# Altium schematic sheet mV_meter.SchDoc: Title
size 420 x 297 mm; Author: G.Kasprowicz; CompanyName: WUT ISE; DrawnBy: G.Kasprowicz; Organization: WUT ISE; Address1: PW ISE; Address2: Nowowiejska 15/19 00-665 Warsaw; Address3: gkasprow@gmail.com; Revision: 2; SheetNumber: 1; SheetTotal: 5; ModifiedBy: -; CheckedDate: -; Title2: Title 2; DivGrp: WUT ISE; Designer: G.Kasprowicz; ModifiedDate: -; ProjectName: Sensor Box
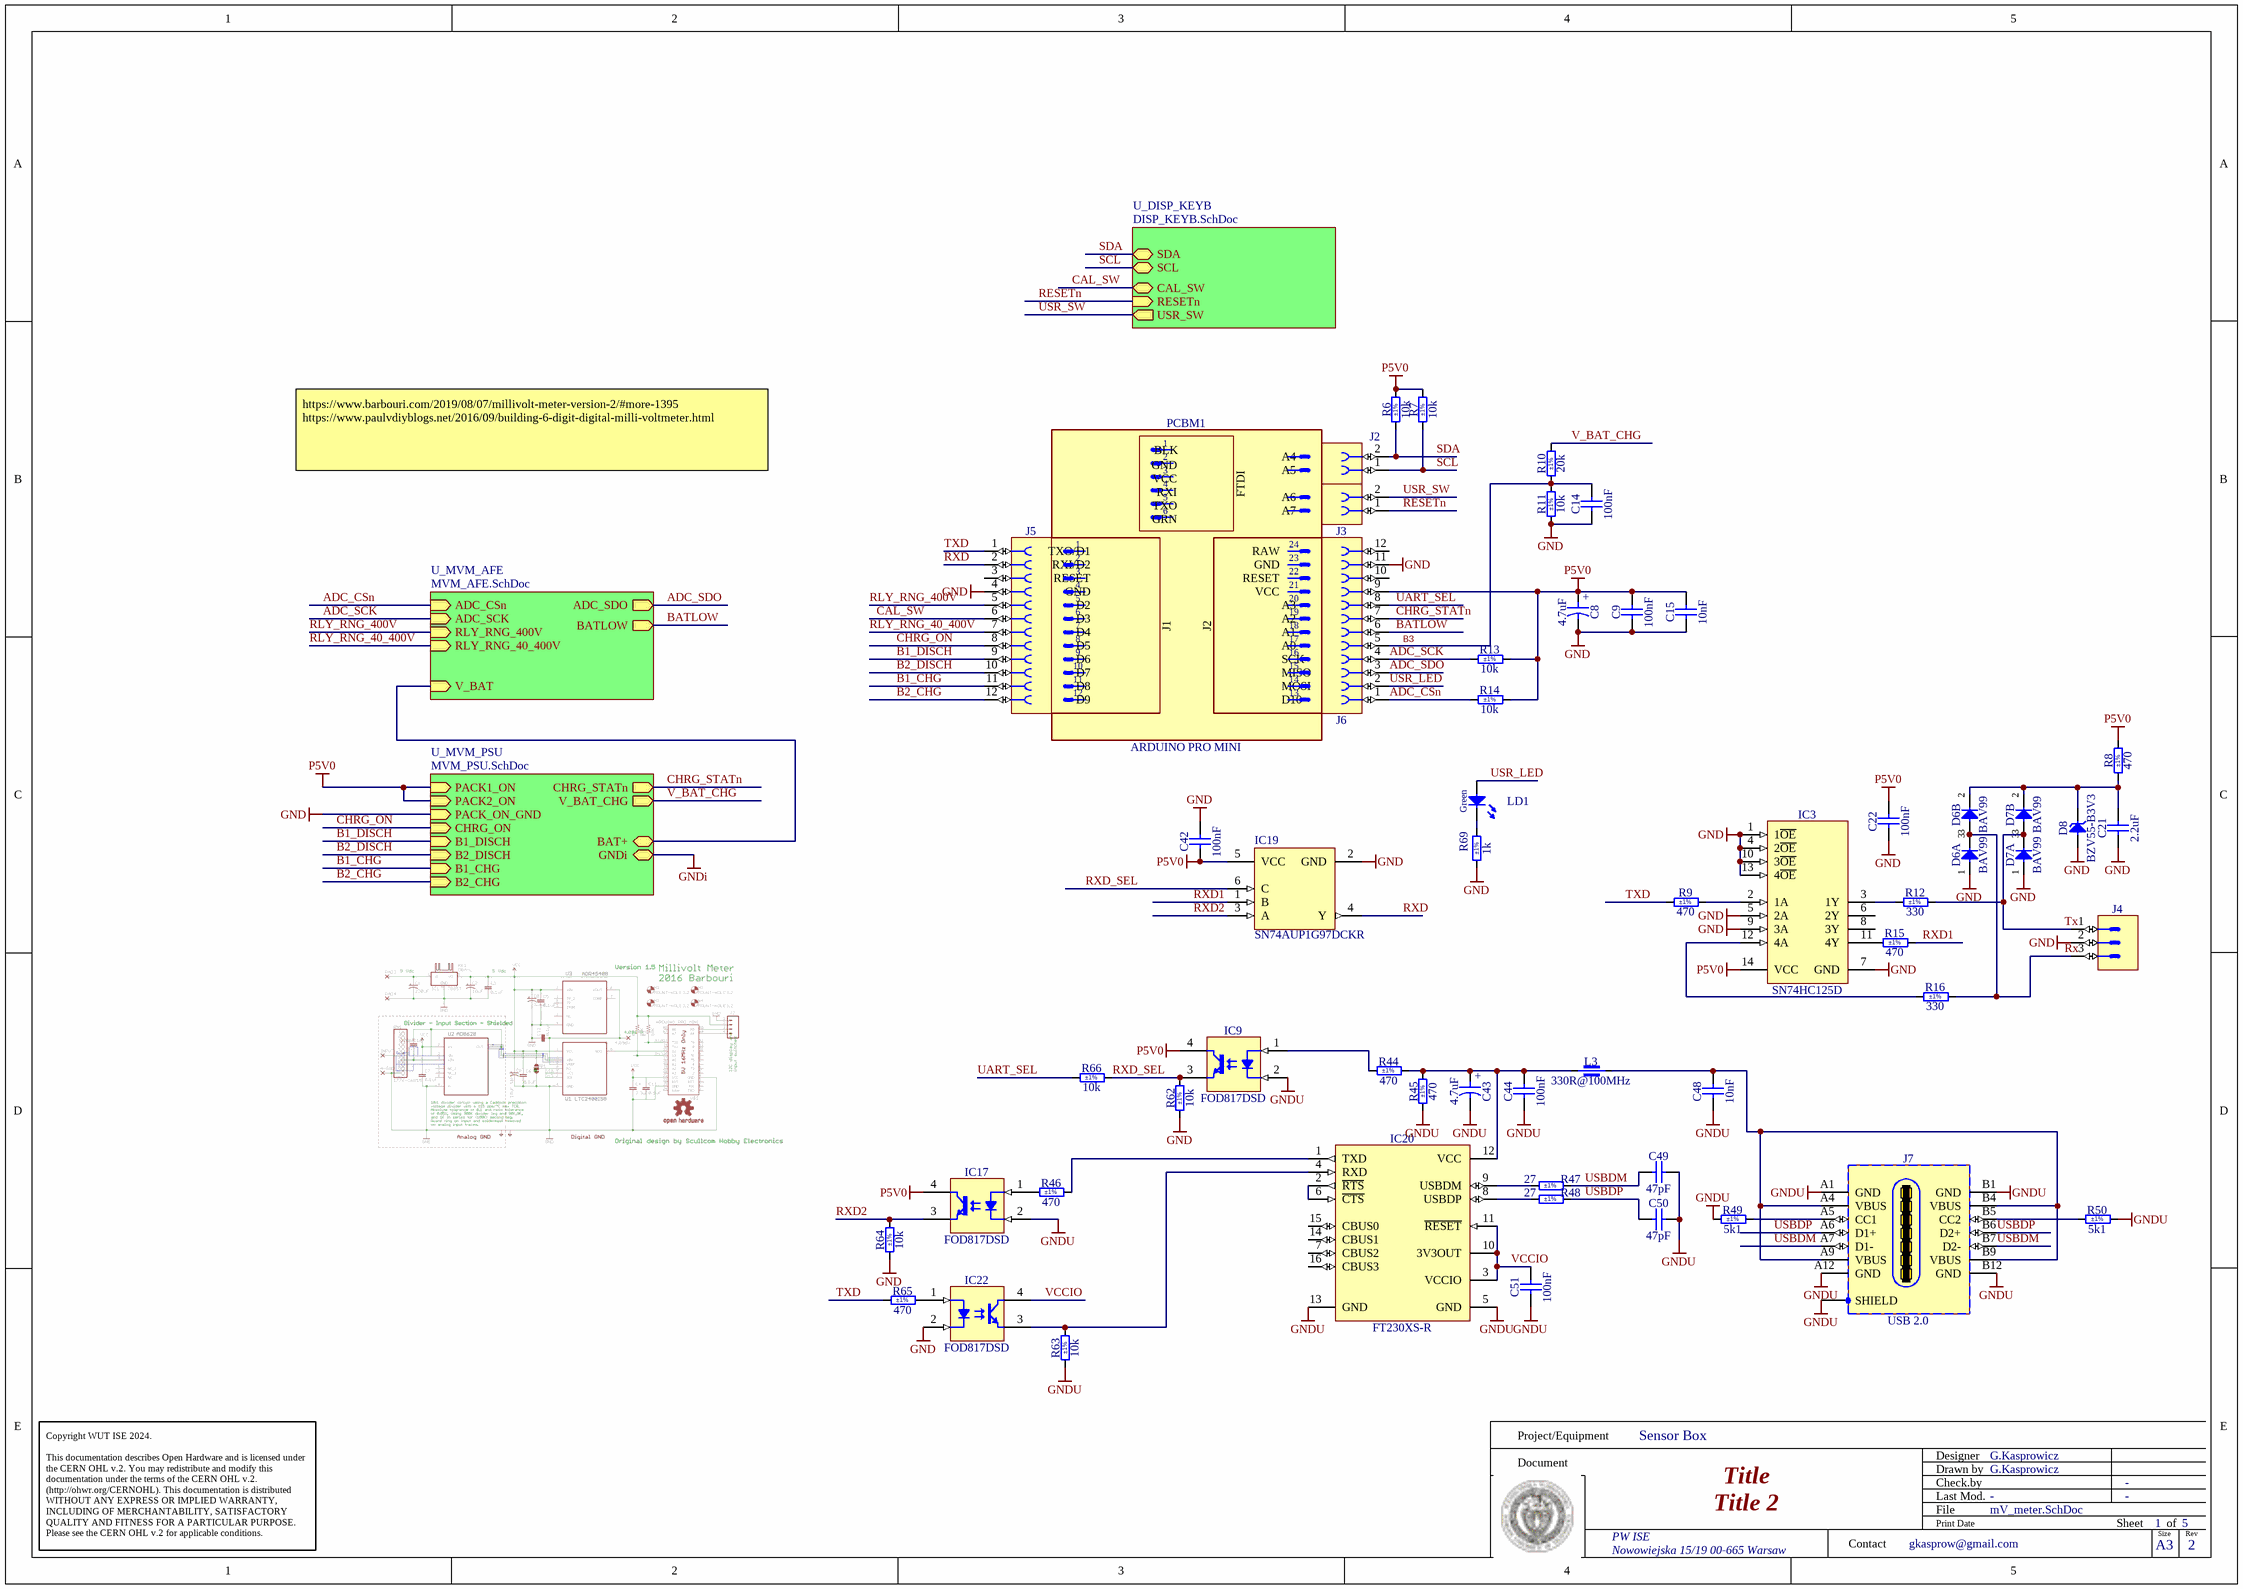
[diagram p0: mV_meter.SchDoc]

## Parts
C8  4.7uF  [CAPMP3216X180N]
C9  100nF  [CAPC2012X88N]
C14  100nF  [CAPC2012X88N]
C15  10nF  [CAPC2012X135N]
C21  2.2uF  [CAPC1608X90N]
C22  100nF  [CAPC1608X90N]
C42  100nF  [CAPC1608X90N]
C43  4.7uF  [CAPMP3216X180N]
C44  100nF  [CAPC1608X90N]
C48  10nF  [CAPC2012X135N]
C49  47pF  [CAPC1608X87N]
C50  47pF  [CAPC1608X87N]
C51  100nF  [CAPC1608X90N]
D6  BAV99  [SOT95P240X110-3N]  (parts A,B of 2)
D7  BAV99  [SOT95P240X110-3N]  (parts A,B of 2)
D8  BZV55-B3V3  [DIOMELF3515N]
IC3  SN74HC125D  [SOIC127P600X175-14N]
IC9  FOD817DSD  [FAIRCHILD_FOD817DSD]
IC17  FOD817DSD  [FAIRCHILD_FOD817DSD]
IC19  SN74AUP1G97DCKR  [DCK0006A_M]
IC20  FT230XS-R  [SOP63P600X175-16N]
IC22  FOD817DSD  [FAIRCHILD_FOD817DSD]
J2  Socket 2  [SAMTEC_SSW-102-02-G-S]  (value not drawn)
J3  Socket 2  [SAMTEC_SSW-102-02-G-S]  (value not drawn)
J4  (no value)  [PHOENIX_1803280]
J5  Socket 12  [SAMTEC_SSW-112-01-G-S]  (value not drawn)
J6  Socket 12  [SAMTEC_SSW-112-01-G-S]  (value not drawn)
J7  USB 2.0  [KYCON_KUSBX-SL-CS1N14-B]
L3  330R@100MHz  [INDC1608X75N]
LD1  Green  [LED_AVAGO_HSME-C110]
PCBM1  ARDUINO PRO MINI  [PCBM_ARDUINO PRO MINI]
R6  10k  Tolerance: ±1%  [RESC1608X55N]
R7  10k  Tolerance: ±1%  [RESC1608X55N]
R8  470  Tolerance: ±1%  [RESC1608X55N]
R9  470  Tolerance: ±1%  [RESC1608X55N]
R10  20k  Tolerance: ±1%  [RESC1608X55N]
R11  10k  Tolerance: ±1%  [RESC1608X55N]
R12  330  Tolerance: ±1%  [RESC1608X55N]
R13  10k  Tolerance: ±1%  [RESC1608X55N]
R14  10k  Tolerance: ±1%  [RESC1608X55N]
R15  470  Tolerance: ±1%  [RESC1608X55N]
R16  330  Tolerance: ±1%  [RESC1608X55N]
R44  470  Tolerance: ±1%  [RESC1608X55N]
R45  470  Tolerance: ±1%  [RESC1608X55N]
R46  470  Tolerance: ±1%  [RESC1608X55N]
R47  27  Tolerance: ±1%  [RESC1608X55N]
R48  27  Tolerance: ±1%  [RESC1608X55N]
R49  5k1  Tolerance: ±1%  [RESC1608X55N]
R50  5k1  Tolerance: ±1%  [RESC1608X55N]
R62  10k  Tolerance: ±1%  [RESC1608X55N]
R63  10k  Tolerance: ±1%  [RESC1608X55N]
R64  10k  Tolerance: ±1%  [RESC1608X55N]
R65  470  Tolerance: ±1%  [RESC1608X55N]
R66  10k  Tolerance: ±1%  [RESC1608X55N]
R69  1k  Tolerance: ±1%  [RESC1608X55N]

## Sub-sheets
U_DISP_KEYB = DISP_KEYB.SchDoc: SDA (bidir), SCL (bidir), CAL_SW (bidir), RESETn (in), USR_SW (out)
U_MVM_AFE = MVM_AFE.SchDoc: ADC_CSn (in), ADC_SCK (in), ADC_SDO (out), RLY_RNG_400V (in), RLY_RNG_40_400V (in), BATLOW (out), V_BAT (in)
U_MVM_PSU = MVM_PSU.SchDoc: PACK1_ON (in), PACK2_ON (in), PACK_ON_GND (in), CHRG_ON (in), CHRG_STATn (out), B1_DISCH (in), B2_DISCH (in), B1_CHG (in), B2_CHG (in), BAT+ (bidir), GNDi (bidir), V_BAT_CHG (out)

## Nets
GND: C8.2 C9.1 C14.1 C15.1 C21.1 C22.1 C42.1 D6.1(A) D7.1(A) D8.2(A) IC3.1(1~{OE}) IC3.4(2~{OE}) IC3.5(2A) IC3.7(GND) IC3.9(3A) IC3.10(3~{OE}) IC3.13(4~{OE}) IC19.2(GND) IC22.2(C) J4.2 J5.4 J6.11 R11.1 R62.1 R64.1 R69.1 ; sheet U_MVM_PSU/PACK_ON_GND
GNDi: sheet U_MVM_PSU/GNDi
GNDU: C43.2 C44.1 C48.1 C49.2 C50.2 C51.1 IC9.2(C) IC17.2(C) IC20.5(GND) IC20.13(GND) J7.A1(GND) J7.A12(GND) J7.B1(GND) J7.B12(GND) J7.SHIELD R45.1 R49.1 R50.2 R63.1
P5V0: C8.1 C9.2 C15.2 C22.2 C42.2 IC3.14(VCC) IC9.4(C) IC17.4(C) IC19.5(VCC) J6.9 R6.2 R7.2 R8.2 R13.2 R14.2 ; sheet U_MVM_PSU/PACK1_ON, sheet U_MVM_PSU/PACK2_ON
ADC_CSn: J6.1 R14.1 ; sheet U_MVM_AFE/ADC_CSn
ADC_SCK: J6.4 R13.1 ; sheet U_MVM_AFE/ADC_SCK
ADC_SDO: J6.3 ; sheet U_MVM_AFE/ADC_SDO
B1_CHG: J5.11 ; sheet U_MVM_PSU/B1_CHG
B1_DISCH: J5.9 ; sheet U_MVM_PSU/B1_DISCH
B2_CHG: J5.12 ; sheet U_MVM_PSU/B2_CHG
B2_DISCH: J5.10 ; sheet U_MVM_PSU/B2_DISCH
B3: C14.2 J6.5 R10.1 R11.2
BATLOW: J6.6 ; sheet U_MVM_AFE/BATLOW
CAL_SW: J5.6 ; sheet U_DISP_KEYB/CAL_SW
CHRG_ON: J5.8 ; sheet U_MVM_PSU/CHRG_ON
CHRG_STATn: J6.7 ; sheet U_MVM_PSU/CHRG_STATn
RESETn: J3.1 ; sheet U_DISP_KEYB/RESETn
RLY_RNG_40_400V: J5.7 ; sheet U_MVM_AFE/RLY_RNG_40_400V
RLY_RNG_400V: J5.5 ; sheet U_MVM_AFE/RLY_RNG_400V
Rx: D6.3(COMAC) J4.3 R16.2
RXD: IC19.4(Y) J5.2
RXD1: IC19.1(B) R15.2
RXD2: IC17.3(E) IC19.3(A) R64.2
RXD_SEL: IC9.3(E) IC19.6(C) R62.2 R66.2
SCL: J2.1 R7.1 ; sheet U_DISP_KEYB/SCL
SDA: J2.2 R6.1 ; sheet U_DISP_KEYB/SDA
Tx: D7.3(COMAC) J4.1 R12.2
TXD: J5.1 R9.1 R65.1
UART_SEL: J6.8 R66.1
USBDM: C49.1 J7.A7(D1-) J7.B7(D2-) R47.2
USBDP: C50.1 J7.A6(D1+) J7.B6(D2+) R48.2
USR_LED: J6.2 LD1.2(A)
USR_SW: J3.2 ; sheet U_DISP_KEYB/USR_SW
V_BAT_CHG: R10.2 ; sheet U_MVM_PSU/V_BAT_CHG
VCCIO: C51.2 IC20.3(VCCIO) IC20.10(3V3OUT) IC20.11(~{RESET}) IC22.4(C)
NetC21_2: C21.2 D6.2(C) D7.2(C) D8.1(C) R8.1
NetC43_1: C43.1 C44.2 IC20.12(VCC) L3.1 R44.2 R45.2
NetC48_2: C48.2 J7.A4(VBUS) J7.A9(VBUS) J7.B4(VBUS) J7.B9(VBUS) L3.2
NetIC3_2: IC3.2(1A) R9.2
NetIC3_3: IC3.3(1Y) R12.1
NetIC3_11: IC3.11(4Y) R15.1
NetIC3_12: IC3.12(4A) R16.1
NetIC9_1: IC9.1(A) R44.1
NetIC17_1: IC17.1(A) R46.1
NetIC20_1: IC20.1(TXD) R46.2
NetIC20_2: IC20.2(~{RTS}) IC20.6(~{CTS})
NetIC20_4: IC20.4(RXD) IC22.3(E) R63.2
NetIC20_8: IC20.8(USBDP) R48.1
NetIC20_9: IC20.9(USBDM) R47.1
NetIC22_1: IC22.1(A) R65.2
NetJ7_A5: J7.A5(CC1) R49.2
NetJ7_B5: J7.B5(CC2) R50.1
NetLD1_1: LD1.1(C) R69.2
(unnamed): sheet U_MVM_PSU/BAT+, sheet U_MVM_AFE/V_BAT

Not connected (* = marked no-connect by the designer): IC3 6(2Y) 8(3Y); IC20 7(CBUS2) 14(CBUS1) 15(CBUS0) 16(CBUS3); J5 3; J6 10 12

## Notes on the sheet
- https://www.barbouri.com/2019/08/07/millivolt-meter-version-2/#more-1395
  https://www.paulvdiyblogs.net/2016/09/building-6-digit-digital-milli-voltmeter.html
- Project/Equipment
- Document
- Designer
- Drawn by
- Check.by
- Copyright WUT ISE 2024.
  This documentation describes Open Hardware and is licensed under the CERN OHL v.2. You may redistribute and modify this documentation under the terms of the CERN OHL v.2. (http://ohwr.org/CERNOHL). This documentation is distributed WITHOUT ANY EXPRESS OR IMPLIED WARRANTY, INCLUDING OF MERCHANTABILITY, SATISFACTORY QUALITY AND FITNESS FOR A PARTICULAR PURPOSE. Please see the CERN OHL v.2 for applicable conditions.
- Contact
- File
- Last Mod.
- Print Date
- Sheet
- Size
- A3
- of
- Rev
- (in symbol CTE3216-18_4.7UF_10V_10%_LESR1400) +
- (in symbol PCBM_ARDUINO PRO MINI extra pins) 1; BLK; 2; A4; GND; 3; A5; VCC; 4; FTDI; RXI; 5; A6; TXO; 6; A7; GRN; 24; TXO/D1; RAW; 23; RXI/D2; 22; RESET; 21; 20; D2; A3; 19; D3; A2; 7; J1; J2; 18; D4; A1; 8; 17; D5; A0; 9; 16; D6; SCK; 10; 15; D7; MISO; 11; 14; D8; MOSI; 12; 13; D9; D10

## Library data of the parts
C8 C43 = CTE3216-18_4.7UF_10V_10%_LESR1400: Polarised capacitor; Part Description: Low ESR 1R4 Solid Tantalum Chip Capacitor; Manufacturer: GENERIC; Manufacturer1 Part Number: TPSA475K010R1400; Voltage: 10V; Tolerance: ±10%; Part Number: CTE3216-18_4.7UF_10V_10%_LESR1400; Component Kind: Standard; Component Type: Standard; Pin Count: 2; Value: 4.7uF; Status: Preferred; Manufacturer Part Number: CTE3216-18_4.7UF_10V_10%_LESR1400; Case: A; Mounted: Yes; Socket: No; SMD: Yes; Sense: No; Manufacturer1 Example: AVX; Manufacturer1 ComponentHeight: 1.8mm; HelpURL: \\cern.ch\dfs\Applications\Altium\Datasheets\CTE-LESR_AVX_TPS.pdf; Author: CERN DEM JLC; CreateDate: 05.05.2008; LatestRevisionDate: 20.01.2009
C9 C14 = CC0805_100NF_50V_1%_NP0: Non-polarised capacitor; Part Description: SMD Multilayer Chip Ceramic Capacitor; Manufacturer: GENERIC; Manufacturer1 Part Number: 0805N103F500C; Voltage: 50V; TC: C0G/NP0; Tolerance: ±1%; Part Number: CC0805_100NF_50V_1%_NP0; Component Kind: Standard; Component Type: Standard; Footprint: CAPC2012X135N; Pin Count: 2; Value: 100nF; Status: Not Recommended; Manufacturer Part Number: CC0805_100NF_50V_1%_NP0; Case: 0805; Mounted: Yes; Socket: No; SMD: Yes; Sense: No; ComponentHeight: 1.35mm; Manufacturer1 Example: WALSIN TECHNOLOGY CORPORATION; Manufacturer1 ComponentHeight: 1.35mm; HelpURL: \\cern.ch\dfs\Applications\Altium\Datasheets\CC0805_WALSIN_0805.pdf; Author: CERN DEM HF; CreateDate: 28.08.2023; LatestRevisionDate: 28.08.2023
C15 C48 = CC0805_10NF_50V_5%_C0G: Non-polarised capacitor; Part Description: SMD Multilayer Chip Ceramic Capacitor; Manufacturer: GENERIC; Manufacturer1 Part Number: C0805C103J5GACTU; Voltage: 50V; TC: C0G/NP0; Tolerance: ±5%; Part Number: CC0805_10NF_50V_5%_C0G; Component Kind: Standard; Component Type: Standard; Pin Count: 2; Value: 10nF; Status: None; Manufacturer Part Number: CC0805_10NF_50V_5%_C0G; Case: 0805; Mounted: Yes; Socket: No; SMD: Yes; Sense: No; Manufacturer1 Example: KEMET; Manufacturer1 ComponentHeight: 0.88mm; HelpURL: \\cern.ch\dfs\Applications\Altium\Datasheets\CC0805_C0G_KEMET_(Commercial Grade).pdf; Author: CERN DEM JLC; CreateDate: 02.02.2011; LatestRevisionDate: 22.04.2015
C21 = CC0603_2.2UF_10V_20%_X7R: Non-polarised capacitor; Part Description: SMD Multilayer Chip Ceramic Capacitor; Manufacturer: GENERIC; Manufacturer1 Part Number: LMK107B7225MA-T; Voltage: 10V; TC: X7R; Tolerance: ±20%; Part Number: CC0603_2.2UF_10V_20%_X7R; Component Kind: Standard; Component Type: Standard; Pin Count: 2; Value: 2.2uF; Status: Not Recommended; Manufacturer Part Number: CC0603_2.2UF_10V_20%_X7R; Case: 0603; Mounted: Yes; Socket: No; SMD: Yes; Sense: No; Manufacturer1 Example: TAIYO YUDEN; Manufacturer1 ComponentHeight: 0.9mm; HelpURL: \\cern.ch\dfs\Applications\Altium\Datasheets\CC0603_X7R_TAIYO-YUDEN_HIGH-VALUE.pdf; Author: CERN DEM JLC; CreateDate: 22.06.2011; LatestRevisionDate: 27.06.2011
C22 C42 C44 C51 = CC0603_100NF_100V_10%_X7R: Non-polarised capacitor; Part Description: SMD Multilayer Chip Ceramic Capacitor; Manufacturer: GENERIC; Manufacturer1 Part Number: GRM188R72A104KA35D; Voltage: 100V; TC: X7R; Tolerance: ±10%; Part Number: CC0603_100NF_100V_10%_X7R; Component Kind: Standard; Component Type: Standard; Pin Count: 2; Value: 100nF; Status: None; Manufacturer Part Number: CC0603_100NF_100V_10%_X7R; Case: 0603; Mounted: Yes; Socket: No; SMD: Yes; Sense: No; Manufacturer1 Example: MURATA; Manufacturer1 ComponentHeight: 0.9mm; HelpURL: \\cern.ch\dfs\Applications\Altium\Datasheets\CC0603_MURATA_GRM188R72A104KA35D.pdf; Author: CERN DEM JLC; CreateDate: 11.12.2013; LatestRevisionDate: 11.12.2013
C49 C50 = CC0603_47PF_50V_5%_NP0: Non-polarised capacitor; Part Description: SMD Multilayer Chip Ceramic Capacitor; Manufacturer: GENERIC; Manufacturer1 Part Number: 223886715479; Voltage: 50V; TC: C0G/NP0; Tolerance: ±5%; Part Number: CC0603_47PF_50V_5%_NP0; Component Kind: Standard; Component Type: Standard; Pin Count: 2; Value: 47pF; Status: Preferred; Manufacturer Part Number: CC0603_47PF_50V_5%_NP0; Case: 0603; Mounted: Yes; Socket: No; SMD: Yes; Sense: No; Manufacturer1 Example: PHYCOMP; Manufacturer1 ComponentHeight: 0.87mm; HelpURL: \\cern.ch\dfs\Applications\Altium\Datasheets\CC0603_NP0_PHYCOMP.pdf; Author: CERN DEM JLC; CreateDate: 03.12.2007; LatestRevisionDate: 03.12.2007
D6 D7 = BAV99: Serial Diode; Part Description: Dual Series Signal Diode; Manufacturer: FAIRCHILD SEMICONDUCTOR; Voltage: 70V; Power: 350mW; PressFit: No; Bonding: No; Part Number: BAV99; Component Kind: Standard; Component Type: Standard; Device: BAV99; PackageDescription: SOT, 0.95mm Pitch; 3 Pin, 1.40mm W X 3.00mm L X 1.10mm H body, IPC Medium Density; Manufacturer Part Number: BAV99; Pin Count: 3; Case: SOT23-3; Mounted: Yes; Socket: No; SMD: Yes; Sense: No; ComponentHeight: 1.1mm; HelpURL: \\cern.ch\dfs\Applications\Altium\Datasheets\BAV99.pdf; Author: CERN DEM JLC; CreateDate: 06.05.2008; LatestRevisionDate: 27.09.2012
D8 = BZV55-B3V3: Zener Diode; Part Description: Voltage Regulator Diode; Manufacturer: NEXPERIA; Voltage: 3V3; Power: 500mW; PressFit: No; Bonding: No; Part Number: BZV55-B3V3; Component Kind: Standard; Component Type: Standard; Device: BZV55-B3V3; PackageDescription: SOD80C, MELF Diode, 2-Leads, Body 3.5x1.5mm, IPC Medium Density; Manufacturer Part Number: BZV55-B3V3; Pin Count: 2; Case: SOD-80C; Mounted: Yes; Socket: No; SMD: Yes; Sense: No; ComponentHeight: 1.6mm; HelpURL: \\cern.ch\dfs\Applications\Altium\Datasheets\BZV55.pdf; Author: CERN DEM JLC; CreateDate: 06.05.2008; LatestRevisionDate: 22.01.2018
IC3 = SN74HC125D: Quadruple Bus Buffer with 3-State Outputs; Manufacturer: TEXAS INSTRUMENTS; PressFit: No; Bonding: No; Part Number: SN74HC125D; Component Kind: Standard; Component Type: Standard; Device: SN74HC125D; PackageDescription: SOIC 14, Pitch 1.27mm - Body 4x8.75mm, IPC Medium Density; Part Description: Quadruple Bus Buffer with 3-State Outputs; Manufacturer Part Number: SN74HC125D; Pin Count: 14; Case: SOIC14; Mounted: Yes; Socket: No; SMD: Yes; Sense: No; ComponentHeight: 1.75mm; Author: CERN DEM JLC; HelpURL: \\cern.ch\dfs\Applications\Altium\Datasheets\SN74HC125D.pdf; CreateDate: 30.06.2011; LatestRevisionDate: 30.06.2011
IC9 IC17 IC22 = FOD817DSD: Single Optocoupler; Part Description: 4-Pin High Operating Temperature Phototransistor Optocoupler; Manufacturer: FAIRCHILD SEMICONDUCTOR; PressFit: No; Bonding: No; Part Number: FOD817DSD; Component Kind: Standard; Component Type: Standard; Device: FOD817DSD; PackageDescription: SOIC, 2.54mm Pitch; 4 Pin, 6.50mm W X 4.60mm L X 4.60mm H body; Manufacturer Part Number: FOD817DSD; Pin Count: 4; Case: SOIC4; Mounted: Yes; Socket: No; SMD: Yes; Sense: No; ComponentHeight: 4.6mm; HelpURL: \\cern.ch\dfs\Applications\Altium\Datasheets\FOD817DSD.pdf; Author: CERN DEM JLC; CreateDate: 21.07.2014; LatestRevisionDate: 21.07.2014
IC19 = CMP-0859-00523-3: Low-Power Configurable Multiple-Function Gate, DCK0006A, LARGE T&R; Manufacturer: Texas Instruments; VCC(Min)(V): 0.8; Logic: True; Output Drive (IOL/IOH)(Max)(mA): 20/-20; 3-State Output: No; Voltage(Nom)(V): 0.8,1.2,1.5,1.8,2.5,3.3; Output Type: CMOS; Rating: Catalog; Technology Family: AUP; VCC(Max)(V): 3.6; Sub-Family: Configurable Logic; Bits(#): 1; ICC @ Nom Voltage(Max)(mA): 0.0009; tpd @ Nom Voltage(Max)(ns): 36.7,21.4,14.8,11.8,8.8,7.3; F @ Nom Voltage(Max)(Mhz): 100; DatasheetVersion: SCES505J; Gate Type: Configurable; Operating Temperature Range(C): -40 to 85; Generic Part Number: SN74AUP1G97; PackageReference: DCK0006A; Schmitt Trigger: No; Input Type: CMOS
IC20 = FT230XS-R: USB To Basic UART IC; Part Description: USB to Serial UART Interface; Manufacturer: FUTURE TECHNOLOGY DEVICES INTERNATIONAL (FTDI); PressFit: No; Bonding: No; Part Number: FT230XS-R; Component Kind: Standard; Component Type: Standard; Device: FT230XS-R; PackageDescription: SOP, 0.635mm Pitch; 16 Pin, 3.9mm W X 4.895mm L X 1.75mm H body, IPC Medium Density; Manufacturer Part Number: FT230XS-R; Pin Count: 16; Case: SSOP16; Mounted: Yes; Socket: No; SMD: Yes; Sense: No; ComponentHeight: 1.75mm; Author: CERN DEM JLC; HelpURL: \\cern.ch\dfs\Applications\Altium\Datasheets\FT230XS-R.pdf; CreateDate: 12.02.2013; LatestRevisionDate: 12.02.2013
J2 J3 = SAMTEC_SSW-102-02-G-S: Connector 2 Female; Part Description: 2 Contacts, Pitch 2.54mm, Single Row Through Mount Straight Socket (Lead Length 4.93mm); Manufacturer: SAMTEC; PressFit: No; Part Number: SAMTEC_SSW-102-02-G-S; Component Kind: Standard; Component Type: Standard; Pin Count: 2; Family: Socket 2; Mounted: Yes; Socket: No; SMD: No; Sense: No; Status: None; Manufacturer Part Number: SSW-102-02-G-S; ComponentHeight: 8.51mm; HelpURL: \\cern.ch\dfs\Applications\Altium\Datasheets\SAMTEC_SSW-102-02-G-S.pdf; Author: CERN DEM JLC; CreateDate: 27.01.2011; LatestRevisionDate: 27.01.2011
J4 = PHOENIX_1803280: Connector 3 Male; Part Description: 8A 160 V, Pitch: 3.81mm, 3 Positions  Right Angled Header; Manufacturer: PHOENIX CONTACT; Manufacturer Part Number: 1803277 (MC 1,5/ 3-G-3,81); PressFit: No; Part Number: PHOENIX_1803280; Component Kind: Standard; Component Type: Standard; Pin Count: 3; Mounted: Yes; Socket: No; SMD: No; Sense: No; Status: None; ComponentHeight: 7.25mm; HelpURL: \\cern.ch\dfs\Applications\Altium\Datasheets\PHOENIX_1803280.pdf; Author: CERN DEM BC; CreateDate: 23.09.2019; LatestRevisionDate: 23.09.2019
J5 J6 = SAMTEC_SSW-112-01-G-S: Connector 12 Female; Part Description: 12 Contacts, Pitch 2.54mm, Single Row Through Mount Straight Socket (Lead Length 2.64mm); Manufacturer: SAMTEC; PressFit: No; Part Number: SAMTEC_SSW-112-01-G-S; Component Kind: Standard; Component Type: Standard; Pin Count: 12; Family: Socket 12; Mounted: Yes; Socket: No; SMD: No; Sense: No; Status: None; Manufacturer Part Number: SSW-112-01-G-S; ComponentHeight: 8.51mm; HelpURL: \\cern.ch\dfs\Applications\Altium\Datasheets\SAMTEC_SSW-112-01-G-S.pdf; Author: CERN DEM BR; CreateDate: 30.04.2019; LatestRevisionDate: 30.04.2019
J7 = KYCON_KUSBX-SL-CS1N14-B: 2x7 Pin + 1 Shield  USB Type C Receptacle; Part Description: USB 2.0 Type C Receptacle, High Temp., Flag Style Through Hole 14 Pin, Black; Manufacturer: KYCON; PressFit: No; Part Number: KYCON_KUSBX-SL-CS1N14-B; Component Kind: Standard; Component Type: Standard; Pin Count: 18; Family: USB 2.0; Mounted: Yes; Socket: No; SMD: No; Sense: No; Status: None; Manufacturer Part Number: KUSBX-SL-CS1N14-B; ComponentHeight: 8.34mm; HelpURL: \\cern.ch\dfs\Applications\Altium\Datasheets\KYCON_KUSBX-SL-CS1N14-B.pdf; Author: CERN DEM BC; CreateDate: 03.11.2020; LatestRevisionDate: 03.11.2020
L3 = IND0603_TDK_MPZ1608S331ATA00: Part Description: SMT Chip Bead for Power Line; Manufacturer: TDK; Power: 1.7A; Resistance: 0.08R; Tolerance: ±25%; Part Number: IND0603_TDK_MPZ1608S331ATA00; Component Kind: Standard; Component Type: Standard; Pin Count: 2; Value: 330R@100MHz; Manufacturer Part Number: MPZ1608S331ATA00; Case: 0603; Mounted: Yes; Socket: No; SMD: Yes; Sense: No; ComponentHeight: 0.8mm; HelpURL: \\cern.ch\dfs\Applications\Altium\Datasheets\IND0603_TDK_MPZ1608.pdf; Author: CERN DEM JLC; CreateDate: 10.01.2018; LatestRevisionDate: 25.10.2018
LD1 = LED_AVAGO_HSME-C110: LED Green 1C 2A; Part Description: High Performance Right Angle Chip Green LED; Manufacturer: AVAGO TECHNOLOGIES; PressFit: No; Bonding: No; Part Number: LED_AVAGO_HSME-C110; Component Kind: Standard; Component Type: Standard; Color: Green; PackageDescription: Green Chip LED, 2-Leads, Body 3.3x1.6mm, Side Emitting Package; Manufacturer Part Number: HSME-C110; Pin Count: 2; Case: 1206; Mounted: Yes; Socket: No; SMD: Yes; Sense: No; ComponentHeight: 1.1mm; HelpURL: \\cern.ch\dfs\Applications\Altium\Datasheets\LED_AVAGO_HSME-C110.pdf; ComponentLink1URL: \\cern.ch\dfs\Applications\Altium\Datasheets\LED_AVAGO_HSME-C110_DESIGN-GUIDE.pdf; ComponentLink1Description: Design Guide; Author: CERN DEM JMW; CreateDate: 30.07.2009; LatestRevisionDate: 20.06.2012
PCBM1 = PCBM_ARDUINO PRO MINI extra pins: Arduino PRO MINI Printed Circuit Board Module; PressFit: No; Bonding: No; Part Number: PCBM_ARDUINO PRO MINI; Component Kind: Accessories; Component Type: Standard; Device: ARDUINO PRO MINI; PackageDescription: Microcontroller Board Arduino PRO MINI; Part Description: Arduino PRO MINI Printed Circuit Board Module; Manufacturer: ARDUINO; Manufacturer Part Number: ARDUINO PRO MINI; Pin Count: 0; Mounted: Yes; Socket: No; SMD: No; Sense: No; ComponentHeight: 15.4mm; Author: CERN DEM HF; HelpURL: \\cern.ch\dfs\Applications\Altium\Datasheets\PCBM_ARDUINO PRO MINI.pdf; CreateDate: 06.09.2022; LatestRevisionDate: 06.09.2022
R6 R7 R11 R13 R14 R62-R64 R66 = R0603_10K_1%_0.1W_100PPM: Resistor - 1%; Part Description: General Purpose Thick Film Chip Resistor; Manufacturer: GENERIC; Manufacturer1 Part Number: NRC06F1002TRF; Power: 0.1W; TC: ±100ppm/°C; PressFit: No; Part Number: R0603_10K_1%_0.1W_100PPM; Component Kind: Standard; Component Type: Standard; Pin Count: 2; Value: 10k; Status: Preferred; Manufacturer Part Number: R0603_10K_1%_0.1W_100PPM; Case: 0603; Mounted: Yes; Sense: No; Socket: No; SMD: Yes; Manufacturer1 Example: NIC COMPONENT; Manufacturer1 ComponentHeight: 0.55mm; HelpURL: \\cern.ch\dfs\Applications\Altium\Datasheets\R0603_NIC_NRC.pdf; Author: CERN DEM JLC; CreateDate: 03.12.2007; LatestRevisionDate: 13.03.2008
R8 R9 R15 R44-R46 R65 = R0603_470R_1%_0.1W_100PPM: Resistor - 1%; Part Description: General Purpose Thick Film Chip Resistor; Manufacturer: GENERIC; Manufacturer1 Part Number: NRC06F4700TRF; Power: 0.1W; TC: ±100ppm/°C; PressFit: No; Part Number: R0603_470R_1%_0.1W_100PPM; Component Kind: Standard; Component Type: Standard; Pin Count: 2; Value: 470; Status: Preferred; Manufacturer Part Number: R0603_470R_1%_0.1W_100PPM; Case: 0603; Mounted: Yes; Sense: No; Socket: No; SMD: Yes; Manufacturer1 Example: NIC COMPONENT; Manufacturer1 ComponentHeight: 0.55mm; HelpURL: \\cern.ch\dfs\Applications\Altium\Datasheets\R0603_NIC_NRC.pdf; Author: CERN DEM JLC; CreateDate: 03.12.2007; LatestRevisionDate: 13.03.2008
R10 = R0603_20K_1%_0.1W_100PPM: Resistor - 1%; Part Description: General Purpose Thick Film Chip Resistor; Manufacturer: GENERIC; Manufacturer1 Part Number: NRC06F2002TRF; Power: 0.1W; TC: ±100ppm/°C; PressFit: No; Part Number: R0603_20K_1%_0.1W_100PPM; Component Kind: Standard; Component Type: Standard; Pin Count: 2; Value: 20k; Status: Preferred; Manufacturer Part Number: R0603_20K_1%_0.1W_100PPM; Case: 0603; Mounted: Yes; Sense: No; Socket: No; SMD: Yes; Manufacturer1 Example: NIC COMPONENT; Manufacturer1 ComponentHeight: 0.55mm; HelpURL: \\cern.ch\dfs\Applications\Altium\Datasheets\R0603_NIC_NRC.pdf; Author: CERN DEM JLC; CreateDate: 03.12.2007; LatestRevisionDate: 13.03.2008
R12 R16 = R0603_330R_1%_0.1W_100PPM: Resistor - 1%; Part Description: General Purpose Thick Film Chip Resistor; Manufacturer: GENERIC; Manufacturer1 Part Number: NRC06F3300TRF; Power: 0.1W; TC: ±100ppm/°C; PressFit: No; Part Number: R0603_330R_1%_0.1W_100PPM; Component Kind: Standard; Component Type: Standard; Pin Count: 2; Value: 330; Status: Preferred; Manufacturer Part Number: R0603_330R_1%_0.1W_100PPM; Case: 0603; Mounted: Yes; Sense: No; Socket: No; SMD: Yes; Manufacturer1 Example: NIC COMPONENT; Manufacturer1 ComponentHeight: 0.55mm; HelpURL: \\cern.ch\dfs\Applications\Altium\Datasheets\R0603_NIC_NRC.pdf; Author: CERN DEM JLC; CreateDate: 03.12.2007; LatestRevisionDate: 13.03.2008
R47 R48 = R0603_27R_1%_0.1W_100PPM: Resistor - 1%; Part Description: General Purpose Thick Film Chip Resistor; Manufacturer: GENERIC; Manufacturer1 Part Number: NRC06F27R0TRF; Power: 0.1W; TC: ±100ppm/°C; PressFit: No; Part Number: R0603_27R_1%_0.1W_100PPM; Component Kind: Standard; Component Type: Standard; Pin Count: 2; Value: 27; Status: Preferred; Manufacturer Part Number: R0603_27R_1%_0.1W_100PPM; Case: 0603; Mounted: Yes; Sense: No; Socket: No; SMD: Yes; Manufacturer1 Example: NIC COMPONENT; Manufacturer1 ComponentHeight: 0.55mm; HelpURL: \\cern.ch\dfs\Applications\Altium\Datasheets\R0603_NIC_NRC.pdf; Author: CERN DEM JLC; CreateDate: 03.12.2007; LatestRevisionDate: 13.03.2008
R49 R50 = R0603_5K1_1%_0.1W_100PPM: Resistor - 1%; Part Description: General Purpose Thick Film Chip Resistor; Manufacturer: GENERIC; Manufacturer1 Part Number: NRC06F5101TRF; Power: 0.1W; TC: ±100ppm/°C; PressFit: No; Part Number: R0603_5K1_1%_0.1W_100PPM; Component Kind: Standard; Component Type: Standard; Pin Count: 2; Value: 5k1; Status: Preferred; Manufacturer Part Number: R0603_5K1_1%_0.1W_100PPM; Case: 0603; Mounted: Yes; Sense: No; Socket: No; SMD: Yes; Manufacturer1 Example: NIC COMPONENT; Manufacturer1 ComponentHeight: 0.55mm; HelpURL: \\cern.ch\dfs\Applications\Altium\Datasheets\R0603_NIC_NRC.pdf; Author: CERN DEM JLC; CreateDate: 03.12.2007; LatestRevisionDate: 13.03.2008
R69 = R0603_1K_1%_0.1W_100PPM: Resistor - 1%; Part Description: General Purpose Thick Film Chip Resistor; Manufacturer: GENERIC; Manufacturer1 Part Number: NRC06F1001TRF; Power: 0.1W; TC: ±100ppm/°C; PressFit: No; Part Number: R0603_1K_1%_0.1W_100PPM; Component Kind: Standard; Component Type: Standard; Pin Count: 2; Value: 1k; Status: Preferred; Manufacturer Part Number: R0603_1K_1%_0.1W_100PPM; Case: 0603; Mounted: Yes; Sense: No; Socket: No; SMD: Yes; Manufacturer1 Example: NIC COMPONENT; Manufacturer1 ComponentHeight: 0.55mm; HelpURL: \\cern.ch\dfs\Applications\Altium\Datasheets\R0603_NIC_NRC.pdf; Author: CERN DEM JLC; CreateDate: 03.12.2007; LatestRevisionDate: 13.03.2008